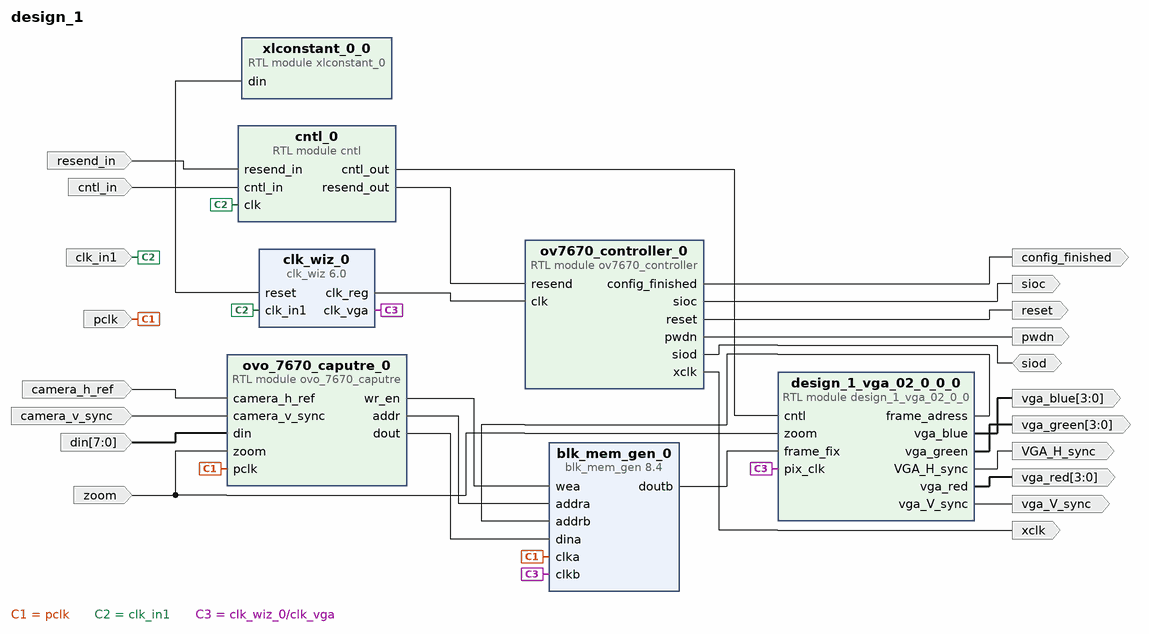
[diagram p0: block diagram of the top level]
# Vivado block design design_1, xc7a100tcsg324-1, Vivado 2019.2
create_bd_design design_1

create_bd_port -dir I camera_h_ref
create_bd_port -dir I camera_v_sync
create_bd_port -dir I -from 7 -to 0 din
create_bd_port -dir I pclk
create_bd_port -dir I zoom
create_bd_port -dir I -type clk clk_in1
create_bd_port -dir I resend_in
create_bd_port -dir I cntl_in
create_bd_port -dir O -from 3 -to 0 vga_blue
create_bd_port -dir O vga_V_sync
create_bd_port -dir O -from 3 -to 0 vga_red
create_bd_port -dir O VGA_H_sync
create_bd_port -dir O -from 3 -to 0 vga_green
create_bd_port -dir O sioc
create_bd_port -dir O config_finished
create_bd_port -dir O -type rst reset
create_bd_port -dir IO siod
create_bd_port -dir O pwdn
create_bd_port -dir O xclk

create_bd_cell -type module -reference cntl cntl_0
create_bd_cell -type module -reference design_1_vga_02_0_0 design_1_vga_02_0_0_0
create_bd_cell -type module -reference ovo_7670_caputre ovo_7670_caputre_0
create_bd_cell -type module -reference xlconstant_0 xlconstant_0_0
create_bd_cell -type ip -vlnv xilinx.com:ip:blk_mem_gen:8.4 blk_mem_gen_0
set_property -dict [list \
  CONFIG.Assume_Synchronous_Clk true \
  CONFIG.Enable_32bit_Address false \
  CONFIG.Enable_A Always_Enabled \
  CONFIG.Enable_B Always_Enabled \
  CONFIG.Memory_Type Simple_Dual_Port_RAM \
  CONFIG.Operating_Mode_A NO_CHANGE \
  CONFIG.Port_B_Clock 100 \
  CONFIG.Port_B_Enable_Rate 100 \
  CONFIG.Read_Width_B 12 \
  CONFIG.Register_PortB_Output_of_Memory_Primitives false \
  CONFIG.Use_Byte_Write_Enable false \
  CONFIG.Write_Depth_A 307200 \
  CONFIG.Write_Width_A 12 \
  CONFIG.Write_Width_B 12 \
  CONFIG.use_bram_block Stand_Alone \
] [get_bd_cells blk_mem_gen_0]
create_bd_cell -type ip -vlnv xilinx.com:ip:clk_wiz:6.0 clk_wiz_0
set_property -dict [list \
  CONFIG.CLKOUT1_JITTER 202.854 \
  CONFIG.CLKOUT1_PHASE_ERROR 235.784 \
  CONFIG.CLKOUT1_REQUESTED_OUT_FREQ 148.500 \
  CONFIG.CLKOUT2_JITTER 299.004 \
  CONFIG.CLKOUT2_PHASE_ERROR 235.784 \
  CONFIG.CLKOUT2_REQUESTED_OUT_FREQ 24.000 \
  CONFIG.CLKOUT2_USED true \
  CONFIG.CLK_OUT1_PORT clk_vga \
  CONFIG.CLK_OUT2_PORT clk_reg \
  CONFIG.MMCM_CLKFBOUT_MULT_F 24.500 \
  CONFIG.MMCM_CLKOUT0_DIVIDE_F 5.500 \
  CONFIG.MMCM_CLKOUT1_DIVIDE 34 \
  CONFIG.MMCM_DIVCLK_DIVIDE 3 \
  CONFIG.NUM_OUT_CLKS 2 \
] [get_bd_cells clk_wiz_0]
create_bd_cell -type module -reference ov7670_controller ov7670_controller_0

# ---- connections ----

connect_bd_net -net camera_h_ref_0_1 [get_bd_ports camera_h_ref] [get_bd_pins ovo_7670_caputre_0/camera_h_ref]
connect_bd_net -net camera_v_sync_0_1 [get_bd_ports camera_v_sync] [get_bd_pins ovo_7670_caputre_0/camera_v_sync]
connect_bd_net -net din_0_1 [get_bd_ports din] [get_bd_pins ovo_7670_caputre_0/din]
connect_bd_net -net pclk_0_1 [get_bd_ports pclk] [get_bd_pins ovo_7670_caputre_0/pclk] [get_bd_pins blk_mem_gen_0/clka]
connect_bd_net -net zoom_0_1 [get_bd_ports zoom] [get_bd_pins ovo_7670_caputre_0/zoom] [get_bd_pins design_1_vga_02_0_0_0/zoom]
connect_bd_net [get_bd_pins xlconstant_0_0/din] [get_bd_pins clk_wiz_0/reset]
connect_bd_net -net clk_in1_0_1 [get_bd_ports clk_in1] [get_bd_pins clk_wiz_0/clk_in1] [get_bd_pins cntl_0/clk]
connect_bd_net -net resend_in_0_1 [get_bd_ports resend_in] [get_bd_pins cntl_0/resend_in]
connect_bd_net -net cntl_in_0_1 [get_bd_ports cntl_in] [get_bd_pins cntl_0/cntl_in]
connect_bd_net [get_bd_pins ovo_7670_caputre_0/wr_en] [get_bd_pins blk_mem_gen_0/wea]
connect_bd_net [get_bd_pins design_1_vga_02_0_0_0/frame_adress] [get_bd_pins blk_mem_gen_0/addrb]
connect_bd_net [get_bd_pins design_1_vga_02_0_0_0/vga_blue] [get_bd_ports vga_blue]
connect_bd_net [get_bd_pins design_1_vga_02_0_0_0/vga_V_sync] [get_bd_ports vga_V_sync]
connect_bd_net [get_bd_pins design_1_vga_02_0_0_0/vga_red] [get_bd_ports vga_red]
connect_bd_net [get_bd_pins design_1_vga_02_0_0_0/VGA_H_sync] [get_bd_ports VGA_H_sync]
connect_bd_net [get_bd_pins design_1_vga_02_0_0_0/vga_green] [get_bd_ports vga_green]
connect_bd_net [get_bd_pins ov7670_controller_0/sioc] [get_bd_ports sioc]
connect_bd_net [get_bd_pins ov7670_controller_0/config_finished] [get_bd_ports config_finished]
connect_bd_net [get_bd_pins ov7670_controller_0/reset] [get_bd_ports reset]
connect_bd_net [get_bd_ports siod] [get_bd_pins ov7670_controller_0/siod]
connect_bd_net [get_bd_pins ov7670_controller_0/pwdn] [get_bd_ports pwdn]
connect_bd_net [get_bd_pins ov7670_controller_0/xclk] [get_bd_ports xclk]
connect_bd_net [get_bd_pins clk_wiz_0/clk_reg] [get_bd_pins ov7670_controller_0/clk]
connect_bd_net [get_bd_pins clk_wiz_0/clk_vga] [get_bd_pins blk_mem_gen_0/clkb] [get_bd_pins design_1_vga_02_0_0_0/pix_clk]
connect_bd_net [get_bd_pins blk_mem_gen_0/doutb] [get_bd_pins design_1_vga_02_0_0_0/frame_fix]
connect_bd_net [get_bd_pins ovo_7670_caputre_0/addr] [get_bd_pins blk_mem_gen_0/addra]
connect_bd_net [get_bd_pins ovo_7670_caputre_0/dout] [get_bd_pins blk_mem_gen_0/dina]
connect_bd_net [get_bd_pins cntl_0/cntl_out] [get_bd_pins design_1_vga_02_0_0_0/cntl]
connect_bd_net [get_bd_pins cntl_0/resend_out] [get_bd_pins ov7670_controller_0/resend]

validate_bd_design
save_bd_design
